# Altium schematic sheet Rpi.SchDoc: CELLULAR
size A2; Engineer: M.GUENI; Revision: R0; SheetNumber: 03; SheetTotal: 10
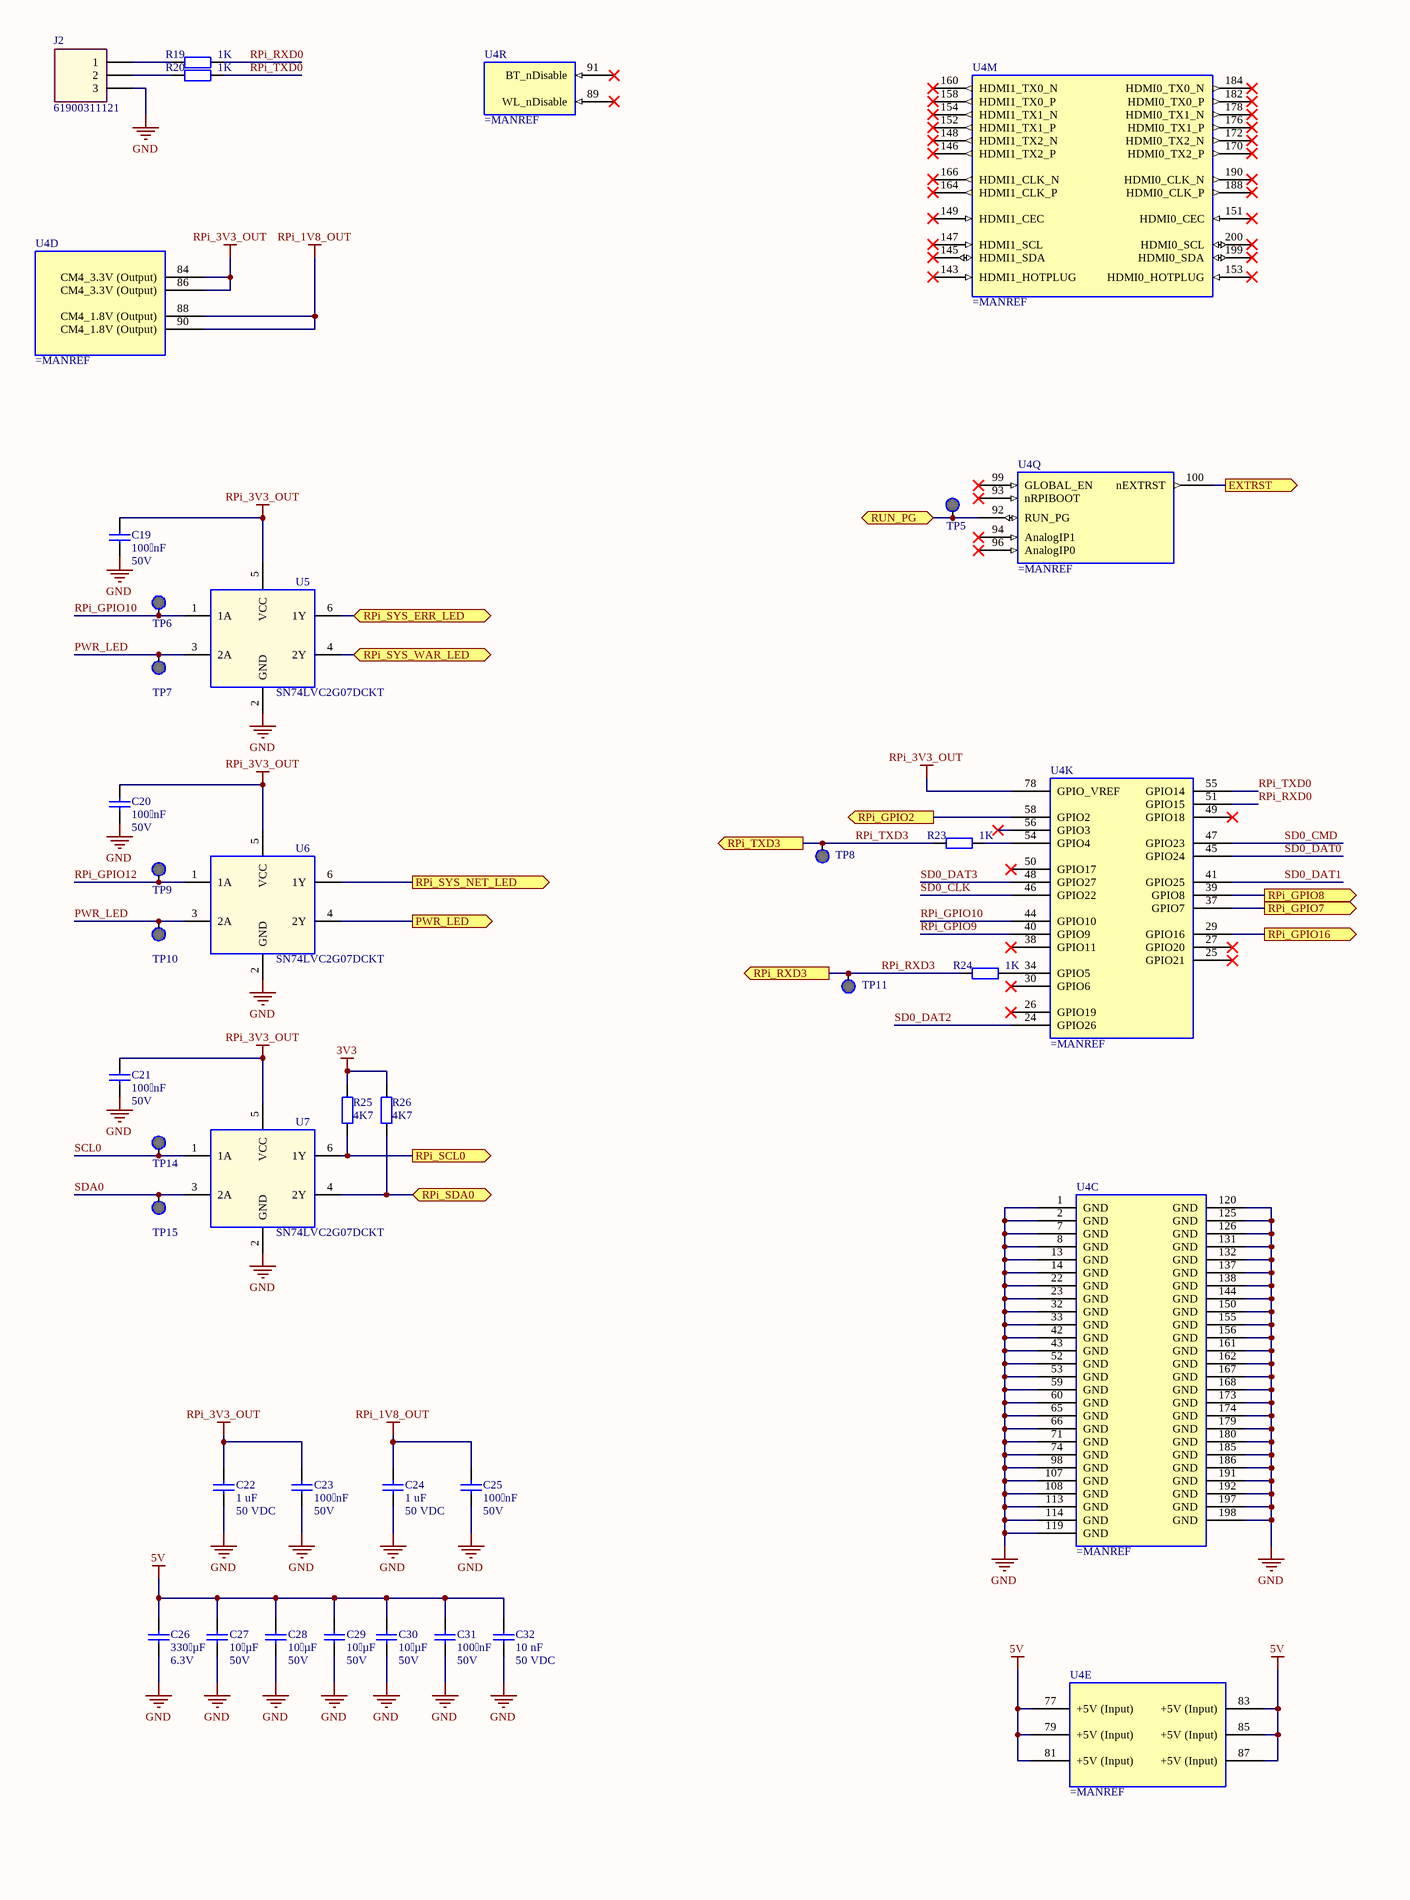
[diagram p0: Rpi.SchDoc, left]
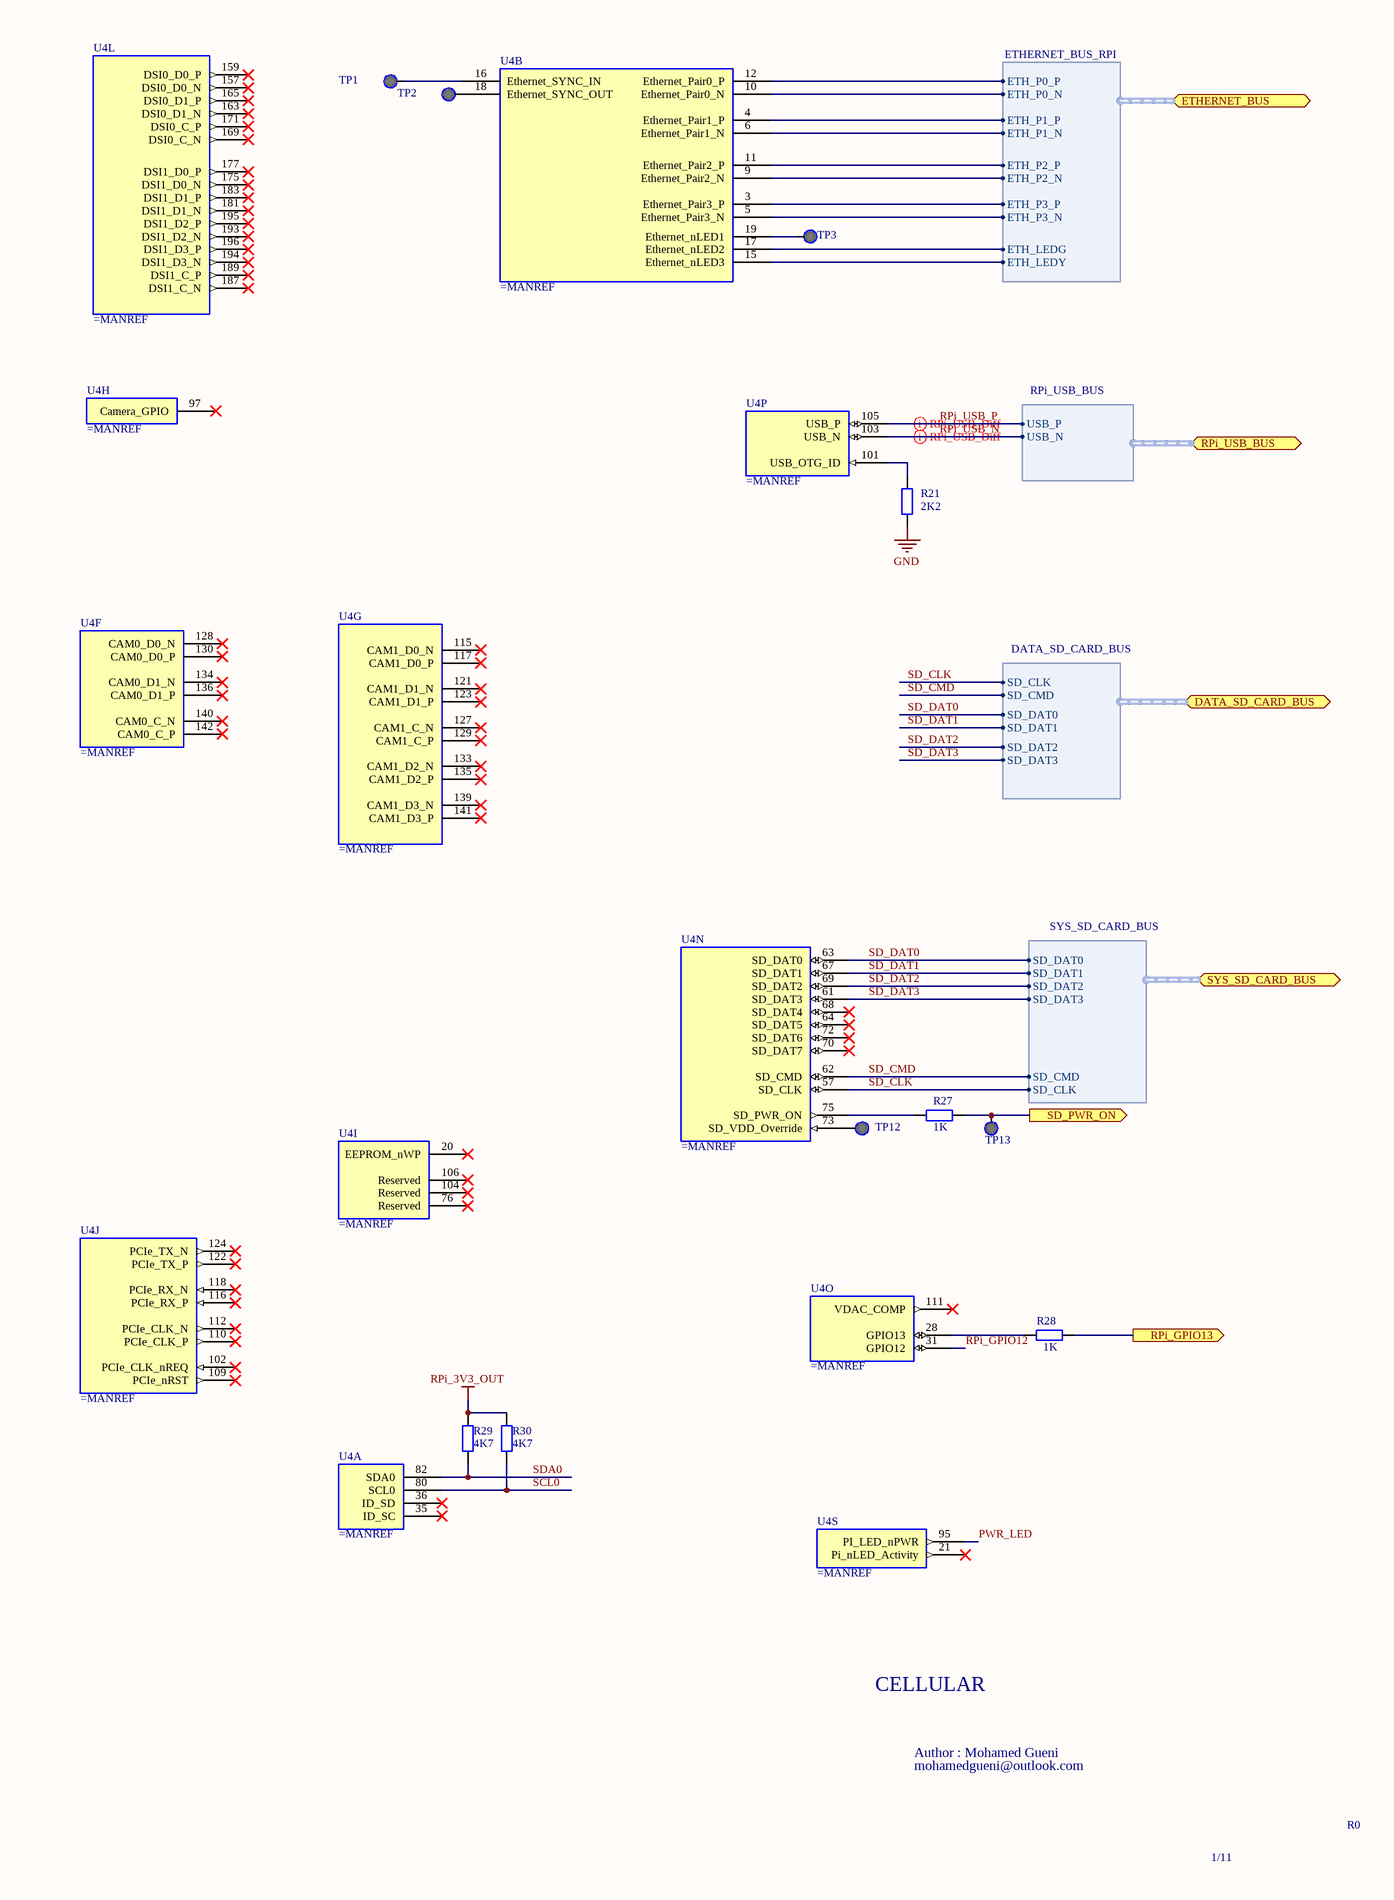
[diagram p1: Rpi.SchDoc, right]

## Parts
C19  Value 1: 100 nF  Value 2: 50V  [CAPC1608N]  (hidden comment: GRM188R71H104KA93D)
C20  Value 1: 100 nF  Value 2: 50V  [CAPC1608N]  (hidden comment: GRM188R71H104KA93D)
C21  Value 1: 100 nF  Value 2: 50V  [CAPC1608N]  (hidden comment: GRM188R71H104KA93D)
C22  Value 1: 1 uF  Value 2: 50 VDC  [CAPC1608N]  (hidden comment: C0603C105K8PACTU)
C23  Value 1: 100 nF  Value 2: 50V  [CAPC1608N]  (hidden comment: GRM188R71H104KA93D)
C24  Value 1: 1 uF  Value 2: 50 VDC  [CAPC1608N]  (hidden comment: C0603C105K8PACTU)
C25  Value 1: 100 nF  Value 2: 50V  [CAPC1608N]  (hidden comment: GRM188R71H104KA93D)
C26  Value 1: 330 µF  Value 2: 6.3V  [CAPC1210]  (hidden comment: T491D337K006AT)
C27  Value 1: 10 µF  Value 2: 50V  [CAPC1608N]  (hidden comment: GRM188R61H106KAALD)
C28  Value 1: 10 µF  Value 2: 50V  [CAPC1608N]  (hidden comment: GRM188R61H106KAALD)
C29  Value 1: 10 µF  Value 2: 50V  [CAPC1608N]  (hidden comment: GRM188R61H106KAALD)
C30  Value 1: 10 µF  Value 2: 50V  [CAPC1608N]  (hidden comment: GRM188R61H106KAALD)
C31  Value 1: 100 nF  Value 2: 50V  [CAPC1608N]  (hidden comment: GRM188R71H104KA93D)
C32  Value 1: 10 nF  Value 2: 50 VDC  [CAPC1608N]  (hidden comment: C0603C103J5RACTU)
J2  61900311121  [61900311121]
R19  Value 1: 1K  [RESC1608N]  (hidden comment: RN731JTTD1001F25)
R20  Value 1: 1K  [RESC1608N]  (hidden comment: RN731JTTD1001F25)
R21  Value 1: 2K2  [RESC1608N]  (hidden comment: RN731JTTD2201F25)
R23  Value 1: 1K  [RESC1608N]  (hidden comment: RN731JTTD1001F25)
R24  Value 1: 1K  [RESC1608N]  (hidden comment: RN731JTTD1001F25)
R25  Value 1: 4K7  [RESC1608N]
R26  Value 1: 4K7  [RESC1608N]
R27  Value 1: 1K  [RESC1608N]  (hidden comment: RN731JTTD1001F25)
R28  Value 1: 1K  [RESC1608N]  (hidden comment: RN731JTTD1001F25)
R29  Value 1: 4K7  [RESC1608N]
R30  Value 1: 4K7  [RESC1608N]
TP1  Test Point  [TP]  (value not drawn)  (no BOM)
TP2  Test Point  [TP]  (value not drawn)  (no BOM)
TP3  Test Point  [TP]  (value not drawn)  (no BOM)
TP5  Test Point  [TP]  (value not drawn)  (no BOM)
TP6  Test Point  [TP]  (value not drawn)  (no BOM)
TP7  Test Point  [TP]  (value not drawn)  (no BOM)
TP8  Test Point  [TP]  (value not drawn)  (no BOM)
TP9  Test Point  [TP]  (value not drawn)  (no BOM)
TP10  Test Point  [TP]  (value not drawn)  (no BOM)
TP11  Test Point  [TP]  (value not drawn)  (no BOM)
TP12  Test Point  [TP]  (value not drawn)  (no BOM)
TP13  Test Point  [TP]  (value not drawn)  (no BOM)
TP14  Test Point  [TP]  (value not drawn)  (no BOM)
TP15  Test Point  [TP]  (value not drawn)  (no BOM)
U4  (no value)  [CM4]  (parts A,B,C,D,E,F,G,H,I,J,K,L,M,N,O,P,Q,R,S of 19)
U5  SN74LVC2G07DCKT  [SOT65P210X1106N]
U6  SN74LVC2G07DCKT  [SOT65P210X1106N]
U7  SN74LVC2G07DCKT  [SOT65P210X1106N]

## Ports
DATA_SD_CARD_BUS (bidir, harness DATA_SD_CARD_BUS), ETHERNET_BUS (bidir, harness ETHERNET_BUS_RPI), EXTRST (out), PWR_LED (out), RPi_GPIO2 (out), RPi_GPIO7 (out), RPi_GPIO8 (out), RPi_GPIO13 (out), RPi_GPIO16 (out), RPi_RXD3 (out), RPi_SCL0 (out), RPi_SDA0 (bidir), RPi_SYS_ERR_LED (bidir), RPi_SYS_NET_LED (out), RPi_SYS_WAR_LED (bidir), RPi_TXD3 (out), RPi_USB_BUS (bidir, harness RPi_USB_BUS), RUN_PG (bidir), SD_PWR_ON (out), SYS_SD_CARD_BUS (bidir, harness SYS_SD_CARD_BUS)

## Harnesses
RPi_USB_BUS: USB_N, USB_P
DATA_SD_CARD_BUS: SD_CMD, SD_CLK, SD_DAT1, SD_DAT0, SD_DAT3, SD_DAT2
SYS_SD_CARD_BUS: SD_CMD, SD_CLK, SD_DAT1, SD_DAT0, SD_DAT3, SD_DAT2
ETHERNET_BUS_RPI: ETH_P3_P, ETH_P3_N, ETH_P0_N, ETH_P0_P, ETH_P1_N, ETH_P1_P, ETH_P2_P, ETH_P2_N, ETH_LEDG, ETH_LEDY

## Nets
3V3: R25.2 R26.2
5V: C26.2 C27.2 C28.2 C29.2 C30.2 C31.2 C32.2 U4.77(+5V_(Input)) U4.79(+5V_(Input)) U4.81(+5V_(Input)) U4.83(+5V_(Input)) U4.85(+5V_(Input)) U4.87(+5V_(Input))
GND: C19.1 C20.1 C21.1 C22.1 C23.1 C24.1 C25.1 C26.1 C27.1 C28.1 C29.1 C30.1 C31.1 C32.1 J2.3 R21.1 U4.1(GND) U4.2(GND) U4.7(GND) U4.8(GND) U4.13(GND) U4.14(GND) U4.22(GND) U4.23(GND) U4.32(GND) U4.33(GND) U4.42(GND) U4.43(GND) U4.52(GND) U4.53(GND) U4.59(GND) U4.60(GND) U4.65(GND) U4.66(GND) U4.71(GND) U4.74(GND) U4.98(GND) U4.107(GND) U4.108(GND) U4.113(GND) U4.114(GND) U4.119(GND) U4.120(GND) U4.125(GND) U4.126(GND) U4.131(GND) U4.132(GND) U4.137(GND) U4.138(GND) U4.144(GND) U4.150(GND) U4.155(GND) U4.156(GND) U4.161(GND) U4.162(GND) U4.167(GND) U4.168(GND) U4.173(GND) U4.174(GND) U4.179(GND) U4.180(GND) U4.185(GND) U4.186(GND) U4.191(GND) U4.192(GND) U4.197(GND) U4.198(GND) U5.2(GND) U6.2(GND) U7.2(GND)
RPi_1V8_OUT: C24.2 C25.2 U4.88(CM4_1.8V_(Output)) U4.90(CM4_1.8V_(Output))
RPi_3V3_OUT: C19.2 C20.2 C21.2 C22.2 C23.2 R29.1 R30.1 U4.78(GPIO_VREF) U4.84(CM4_3.3V_(Output)) U4.86(CM4_3.3V_(Output)) U5.5(VCC) U6.5(VCC) U7.5(VCC)
EXTRST: U4.100(nEXTRST) ; port EXTRST
PWR_LED: TP7.1 TP10.1 U4.95(PI_LED_nPWR) U5.3(2A) U6.3(2A)
PWR_LED: U6.4(2Y) ; port PWR_LED  [a separate net that carries the same name]
RPi_GPIO2: U4.58(GPIO2) ; port RPi_GPIO2
RPi_GPIO7: U4.37(GPIO7) ; port RPi_GPIO7
RPi_GPIO8: U4.39(GPIO8) ; port RPi_GPIO8
RPi_GPIO9: U4.40(GPIO9)
RPi_GPIO10: TP6.1 U4.44(GPIO10) U5.1(1A)
RPi_GPIO12: TP9.1 U4.31(GPIO12) U6.1(1A)
RPi_GPIO13: R28.1 ; port RPi_GPIO13
RPi_GPIO16: U4.29(GPIO16) ; port RPi_GPIO16
RPi_RXD0: R19.2 U4.51(GPIO15)
RPi_RXD3: R24.1 TP11.1 ; port RPi_RXD3
RPi_SCL0: R25.1 U7.6(1Y) ; port RPi_SCL0
RPi_SDA0: R26.1 U7.4(2Y) ; port RPi_SDA0
RPi_SYS_ERR_LED: U5.6(1Y) ; port RPi_SYS_ERR_LED
RPi_SYS_NET_LED: U6.6(1Y) ; port RPi_SYS_NET_LED
RPi_SYS_WAR_LED: U5.4(2Y) ; port RPi_SYS_WAR_LED
RPi_TXD0: R20.2 U4.55(GPIO14)
RPi_TXD3: R23.1 TP8.1 ; port RPi_TXD3
RPi_USB_N: U4.103(USB_N) ; port RPi_USB_BUS.USB_N
RPi_USB_P: U4.105(USB_P) ; port RPi_USB_BUS.USB_P
RUN_PG: TP5.1 U4.92(RUN_PG) ; port RUN_PG
SCL0: R30.2 TP14.1 U4.80(SCL0) U7.1(1A)
SD0_CLK: U4.46(GPIO22)
SD0_CMD: U4.47(GPIO23)
SD0_DAT0: U4.45(GPIO24)
SD0_DAT1: U4.41(GPIO25)
SD0_DAT2: U4.24(GPIO26)
SD0_DAT3: U4.48(GPIO27)
SD_CLK: U4.57(SD_CLK) ; port DATA_SD_CARD_BUS.SD_CLK, port SYS_SD_CARD_BUS.SD_CLK
SD_CMD: U4.62(SD_CMD) ; port DATA_SD_CARD_BUS.SD_CMD, port SYS_SD_CARD_BUS.SD_CMD
SD_DAT0: U4.63(SD_DAT0) ; port DATA_SD_CARD_BUS.SD_DAT0, port SYS_SD_CARD_BUS.SD_DAT0
SD_DAT1: U4.67(SD_DAT1) ; port DATA_SD_CARD_BUS.SD_DAT1, port SYS_SD_CARD_BUS.SD_DAT1
SD_DAT2: U4.69(SD_DAT2) ; port DATA_SD_CARD_BUS.SD_DAT2, port SYS_SD_CARD_BUS.SD_DAT2
SD_DAT3: U4.61(SD_DAT3) ; port DATA_SD_CARD_BUS.SD_DAT3, port SYS_SD_CARD_BUS.SD_DAT3
SD_PWR_ON: R27.1 TP13.1 ; port SD_PWR_ON
SDA0: R29.2 TP15.1 U4.82(SDA0) U7.3(2A)
NetJ2_1: J2.1 R19.1
NetJ2_2: J2.2 R20.1
NetR21_2: R21.2 U4.101(USB_OTG_ID)
NetR23_2: R23.2 U4.54(GPIO4)
NetR24_2: R24.2 U4.34(GPIO5)
NetR27_2: R27.2 U4.75(SD_PWR_ON)
NetR28_2: R28.2 U4.28(GPIO13)
NetTP1_1: TP1.1 U4.16(Ethernet_SYNC_IN)
NetTP2_1: TP2.1 U4.18(Ethernet_SYNC_OUT)
NetTP3_1: TP3.1 U4.19(Ethernet_nLED1)
NetTP12_1: TP12.1 U4.73(SD_VDD_Override)
NetU4_3: U4.3(Ethernet_Pair3_P) ; port ETHERNET_BUS.ETH_P3_P
NetU4_4: U4.4(Ethernet_Pair1_P) ; port ETHERNET_BUS.ETH_P1_P
NetU4_5: U4.5(Ethernet_Pair3_N) ; port ETHERNET_BUS.ETH_P3_N
NetU4_6: U4.6(Ethernet_Pair1_N) ; port ETHERNET_BUS.ETH_P1_N
NetU4_9: U4.9(Ethernet_Pair2_N) ; port ETHERNET_BUS.ETH_P2_N
NetU4_10: U4.10(Ethernet_Pair0_N) ; port ETHERNET_BUS.ETH_P0_N
NetU4_11: U4.11(Ethernet_Pair2_P) ; port ETHERNET_BUS.ETH_P2_P
NetU4_12: U4.12(Ethernet_Pair0_P) ; port ETHERNET_BUS.ETH_P0_P
NetU4_15: U4.15(Ethernet_nLED3) ; port ETHERNET_BUS.ETH_LEDY
NetU4_17: U4.17(Ethernet_nLED2) ; port ETHERNET_BUS.ETH_LEDG

Not connected (* = marked no-connect by the designer): U4 20(EEPROM_nWP)* 21(Pi_nLED_Activity)* 25(GPIO21)* 26(GPIO19)* 27(GPIO20)* 30(GPIO6)* 35(ID_SC)* 36(ID_SD)* 38(GPIO11)* 49(GPIO18)* 50(GPIO17)* 56(GPIO3)* 64(SD_DAT5)* 68(SD_DAT4)* 70(SD_DAT7)* 72(SD_DAT6)* 76(Reserved)* 89(WL_nDisable)* 91(BT_nDisable)* 93(nRPIBOOT)* 94(AnalogIP1)* 96(AnalogIP0)* 97(Camera_GPIO)* 99(GLOBAL_EN)* 102(PCIe_CLK_nREQ)* 104(Reserved)* 106(Reserved)* 109(PCIe_nRST)* 110(PCIe_CLK_P)* 111(VDAC_COMP)* 112(PCIe_CLK_N)* 115(CAM1_D0_N)* 116(PCIe_RX_P)* 117(CAM1_D0_P)* 118(PCIe_RX_N)* 121(CAM1_D1_N)* 122(PCIe_TX_P)* 123(CAM1_D1_P)* 124(PCIe_TX_N)* 127(CAM1_C_N)* 128(CAM0_D0_N)* 129(CAM1_C_P)* 130(CAM0_D0_P)* 133(CAM1_D2_N)* 134(CAM0_D1_N)* 135(CAM1_D2_P)* 136(CAM0_D1_P)* 139(CAM1_D3_N)* 140(CAM0_C_N)* 141(CAM1_D3_P)* 142(CAM0_C_P)* 143(HDMI1_HOTPLUG)* 145(HDMI1_SDA)* 146(HDMI1_TX2_P)* 147(HDMI1_SCL)* 148(HDMI1_TX2_N)* 149(HDMI1_CEC)* 151(HDMI0_CEC)* 152(HDMI1_TX1_P)* 153(HDMI0_HOTPLUG)* 154(HDMI1_TX1_N)* 157(DSI0_D0_N)* 158(HDMI1_TX0_P)* 159(DSI0_D0_P)* 160(HDMI1_TX0_N)* 163(DSI0_D1_N)* 164(HDMI1_CLK_P)* 165(DSI0_D1_P)* 166(HDMI1_CLK_N)* 169(DSI0_C_N)* 170(HDMI0_TX2_P)* 171(DSI0_C_P)* 172(HDMI0_TX2_N)* 175(DSI1_D0_N)* 176(HDMI0_TX1_P)* 177(DSI1_D0_P)* 178(HDMI0_TX1_N)* 181(DSI1_D1_N)* 182(HDMI0_TX0_P)* 183(DSI1_D1_P)* 184(HDMI0_TX0_N)* 187(DSI1_C_N)* 188(HDMI0_CLK_P)* 189(DSI1_C_P)* 190(HDMI0_CLK_N)* 193(DSI1_D2_N)* 194(DSI1_D3_N)* 195(DSI1_D2_P)* 196(DSI1_D3_P)* 199(HDMI0_SDA)* 200(HDMI0_SCL)*

## Layout directives
differential pair; differential pair class RPi_USB_Diff: RPi_USB_N, RPi_USB_P

## Notes on the sheet
- CELLULAR
- Author : Mohamed Gueni
- mohamedgueni@outlook.com
- 1/11
- R0
- Title:
- Micro Device Tunisie
- Size:
- Date:
- File:
- A3
- Engineer :
- Revision:
- Sheet
- of
- Cyber Parc  Hammam Sousse
- Avenue Charles De Gaulle
- 4011, Hammam-Sousse, Tunisie
- contact@mdtunisie.com

## Library data of the parts
C19-C21 C23 C25 C31 = CAP-000000017: MAN: Murata; DES: Ceramic Capacitor, 100 nF, 50V, X7R, 0603; FTP: 603; SUPREF: 81-GRM188R71H104KA93D; Part Number: CAP-000000017; MANREF: GRM188R71H104KA93D
C22 C24 = CAP-000000005: MAN: KEMET; DES: Multilayer Ceramic Capacitors MLCC - SMD/SMT 10v 1uF X5R 0603 10%; TOL: 10 %; FTP: 0603; SUP: Mouser; SUPREF: 80-C0603C105K8P; NOTE: _; Part Number: CAP-000000005; MANREF: C0603C105K8PACTU
C26 = CAP-000000011: MAN: KEMET; DES: Tantalum Capacitor, 330 µF, 6.3V, 1210; FTP: 1210; SUPREF: 581-T491D337K006AT; Part Number: CAP-000000011; MANREF: T491D337K006AT
C27-C30 = CAP-000000025: MAN: Murata; DES: Ceramic Capacitor, 10 µF, 50V, X5R, 0603; FTP: 603; SUPREF: 81-GRM188R61H106KAALD; Part Number: CAP-000000025; MANREF: GRM188R61H106KAALD
C32 = CAP-000000006: MAN: KEMET; DES: Multilayer Ceramic Capacitors MLCC - SMD/SMT 50V 0.01uF 0603 X7R 5%; TOL: 5 %; FTP: 0603; SUP: Mouser; SUPREF: 80-C0603C103J5R; NOTE: _; Part Number: CAP-000000006; MANREF: C0603C103J5RACTU
J2 = CON-000000013: MAN: Wurth Elektronik; DES: Headers & Wire Housings WR-WTB 2.54mm Male 3Pin Lckg; Value 1: _; FTP: THT; SUP: Mouser; SUPREF: 710-61900311121; Part Number: CON-000000013; MANREF: 61900311121; Value 2: _; TOL: _; NOTE: _
R19 R20 R23 R24 R27 R28 = RES-000000001: MAN: KOA Speer; DES: Thin Film Resistors - SMD 1kOhm,0603,1%,25ppm, 63mW,50V; Value 2: 0.63W; TOL: 1%; FTP: 0603; SUP: Mouser; SUPREF: 660-RN731JTTD1001F25; NOTE: _; Part Number: RES-000000001; MANREF: RN731JTTD1001F25
R21 = RES-000000006: MAN: KOA Speer; DES: Thin Film Resistors - SMD 2.2kOhm,0603,1%,25pp m,63mW,50V; Value 2: 0.1W; TOL: 1%; FTP: 0603; SUP: Mouser; SUPREF: 660-RN731JTTD2201F25; NOTE: _; Part Number: RES-000000006; MANREF: RN731JTTD2201F25
R25 R26 R29 R30 = RES-000000010: FTP: 0603; SUP: Mouser; NOTE: _; Part Number: RES-000000010
TP1-TP3 TP5-TP15 = MIS-000000002: MAN: _; Part Number: MIS-000000002; MANREF: _; DES: _; Value 1: _; Value 2: _; TOL: _; FTP: _; SUP: _; SUPREF: _; NOTE: _
U4 = MIS-000000006: NOTE: _; Part Number: MIS-000000006
U5-U7 = GIC-000000009: Dual Buffer/Driver with Open-Drain Output; Manufacturer_Name: Texas Instruments; Geometry.Height: 1.1mm; DES: Buffers & Line Drivers Dual Buffer Driver A 595-SN74LVC2G07DCKR; Value 1: 5.5 V; Value 2: 32 mA; TOL: _; FTP: SOT-353-SC70-6; SUP: Mouser; SUPREF: 595-SN74LVC2G07DCKT; Mouser Part Number: 595-SN74LVC2G07DCKT; Mouser Price/Stock: https://www.mouser.co.uk/ProductDetail/Texas-Instruments/SN74LVC2G07DCKT?qs=pajgIaoyDUh%252B8BjKWdvxSw%3D%3D; Manufacturer_Part_Number: SN74LVC2G07DCKT; Datasheet Link: http://www.ti.com/lit/gpn/SN74LVC2G07; Part Number: GIC-000000009; MAN: Texas Instruments; MANREF: SN74LVC2G07DCKT; NOTE: _